# Altium schematic sheet Radio.SchDoc
size A3; DocumentNumber: 10; SheetNumber: 5; SheetTotal: 18
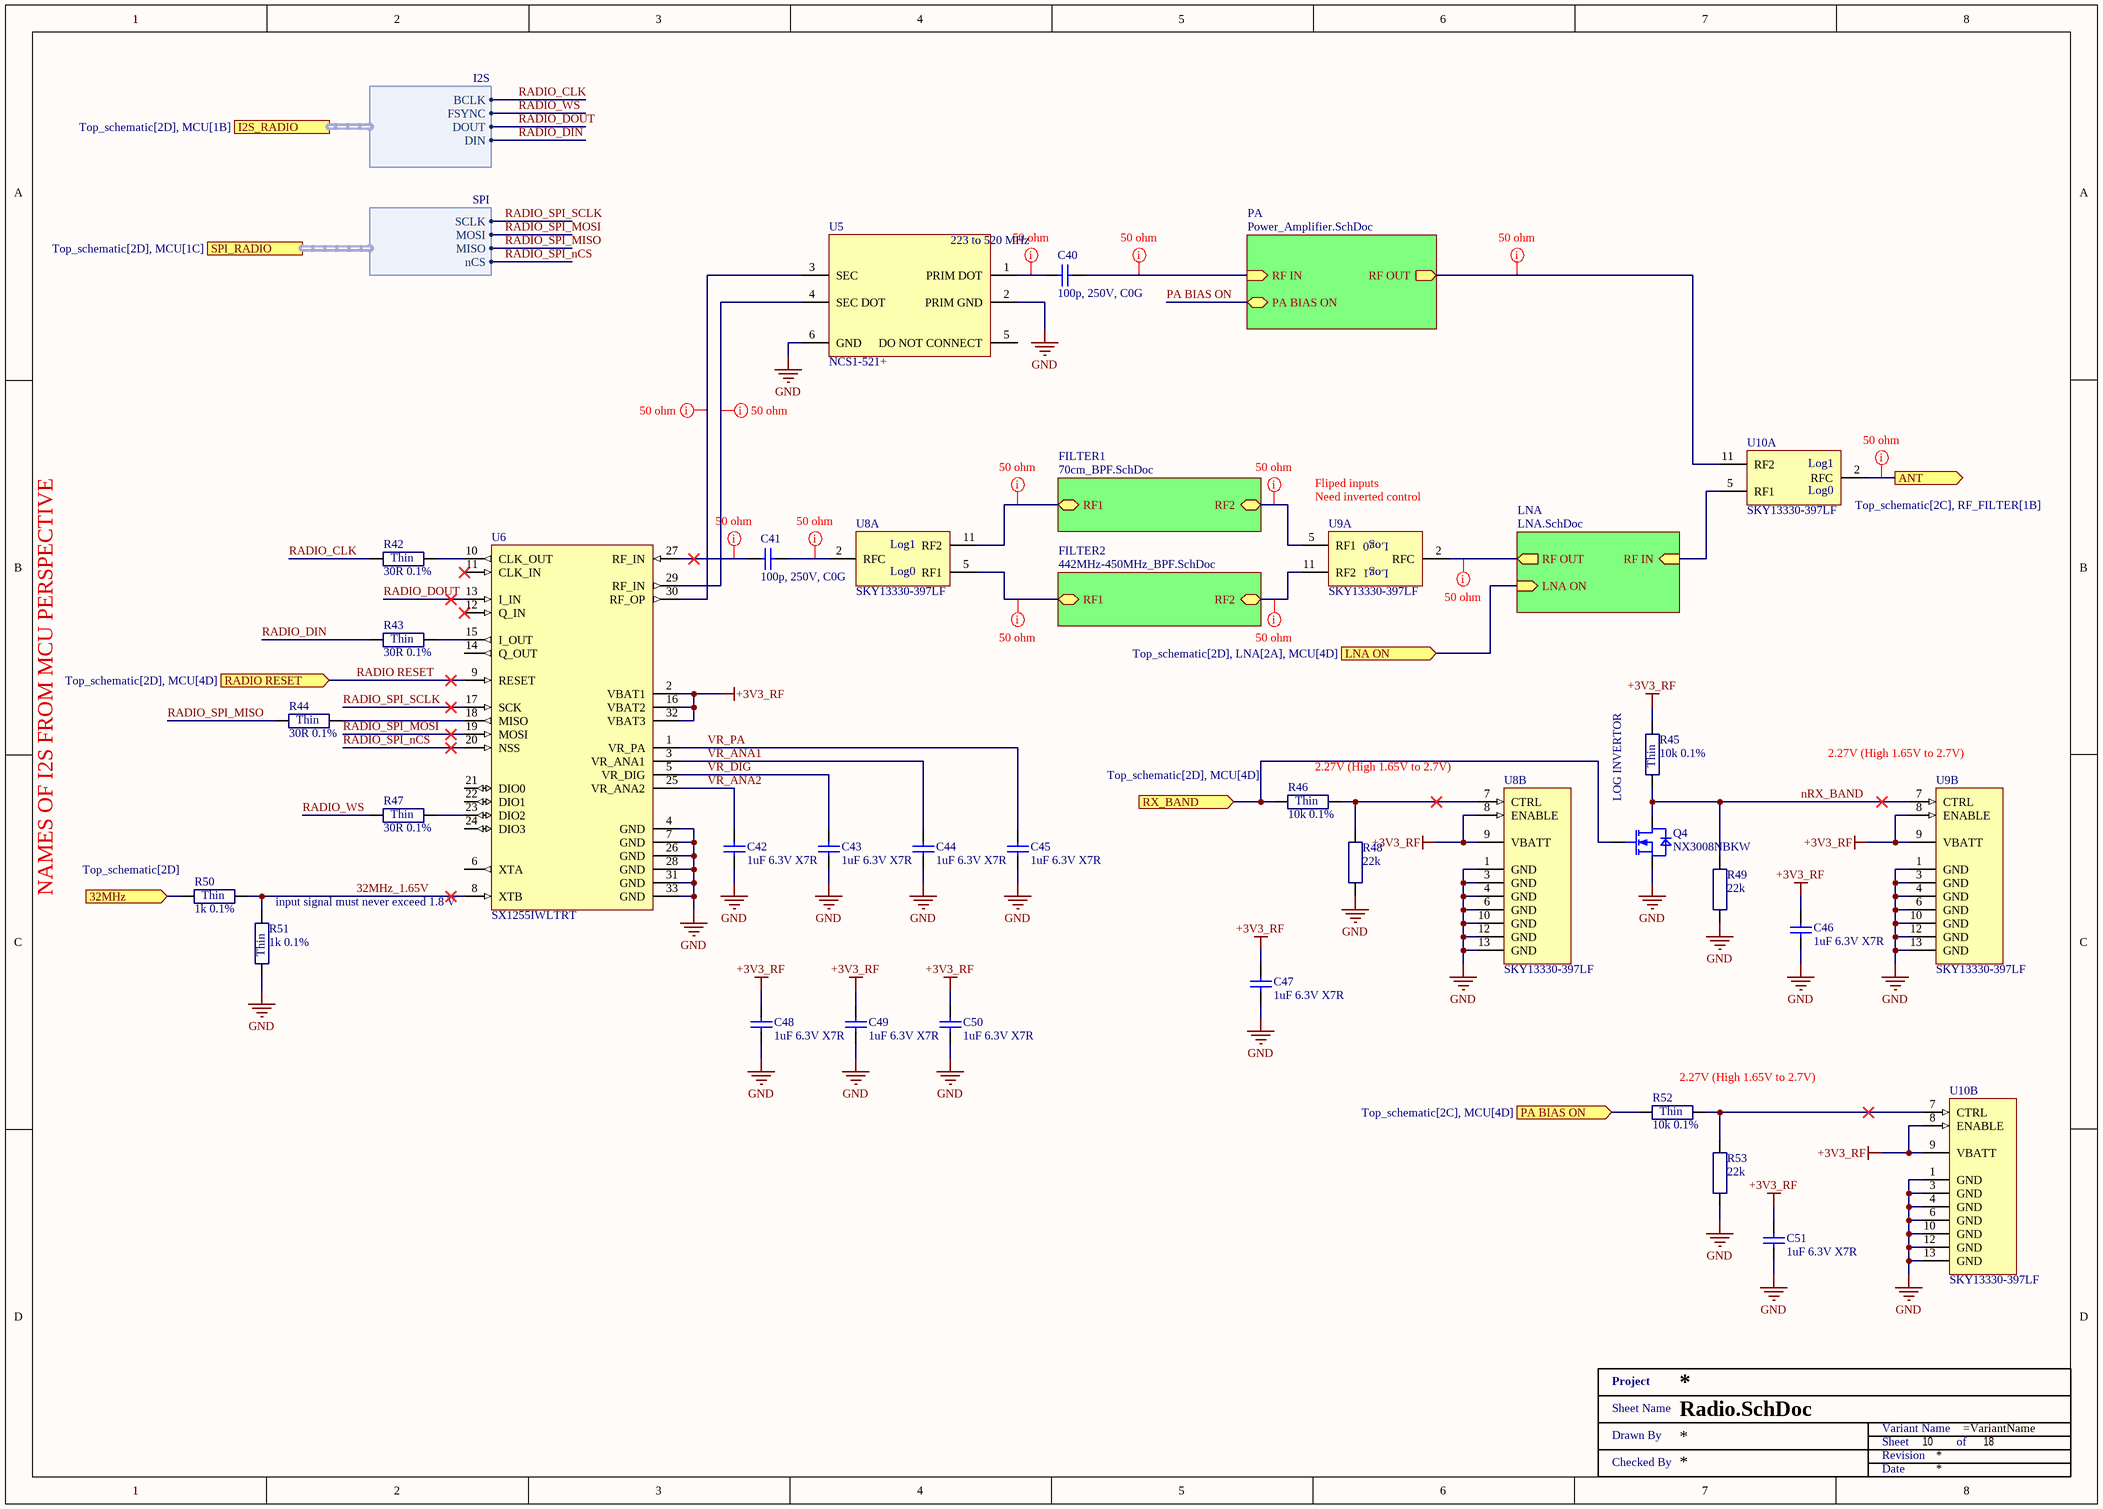
[diagram p0: Radio.SchDoc]

## Parts
C40  100p, 250V, C0G  [SMD0603]
C41  100p, 250V, C0G  [SMD0603]
C42  1uF 6.3V X7R  [SMD0402]
C43  1uF 6.3V X7R  [SMD0402]
C44  1uF 6.3V X7R  [SMD0402]
C45  1uF 6.3V X7R  [SMD0402]
C46  1uF 6.3V X7R  [SMD0402]
C47  1uF 6.3V X7R  [SMD0402]
C48  1uF 6.3V X7R  [SMD0402]
C49  1uF 6.3V X7R  [SMD0402]
C50  1uF 6.3V X7R  [SMD0402]
C51  1uF 6.3V X7R  [SMD0402]
Q4  NX3008NBKW  [SOT323]
R42  30R 0.1%  [SMD0402 - R]
R43  30R 0.1%  [SMD0402 - R]
R44  30R 0.1%  [SMD0402 - R]
R45  10k 0.1%  [SMD0402 - R]
R46  10k 0.1%  [SMD0402 - R]
R47  30R 0.1%  [SMD0402 - R]
R48  22k  [SMD0402 - R]
R49  22k  [SMD0402 - R]
R50  1k 0.1%  [SMD0402 - R]
R51  1k 0.1%  [SMD0402 - R]
R52  10k 0.1%  [SMD0402 - R]
R53  22k  [SMD0402 - R]
U5  NCS1-521+  [SMD_0805_6PIN_OPRAVA]
U6  SX1255IWLTRT  [QFN32-2]
U8  SKY13330-397LF  [QFN50P200X200X100_HS-13N]  (parts A,B of 2)
U9  SKY13330-397LF  [QFN50P200X200X100_HS-13N]  (parts A,B of 2)
U10  SKY13330-397LF  [QFN50P200X200X100_HS-13N]  (parts A,B of 2)
XX?  Title 1  (value not drawn)  (graphical)

## Sub-sheets
FILTER1 = 70cm_BPF.SchDoc: RF1 (bidir), RF2 (bidir)
FILTER2 = 442MHz-450MHz_BPF.SchDoc: RF1 (bidir), RF2 (bidir)
LNA = LNA.SchDoc: LNA ON (in), RF OUT (out), RF IN (in)
PA = Power_Amplifier.SchDoc: PA BIAS ON (bidir), RF IN (in), RF OUT (out)

## Ports
32MHz (in, see Top_schematic[2D]), ANT (out, see Top_schematic[2C], RF_FILTER[1B]), I2S_RADIO (harness I2S, see Top_schematic[2D], MCU[1B]), LNA ON (in, see Top_schematic[2D], LNA[2A], MCU[4D]), PA BIAS ON (in, see Top_schematic[2C], MCU[4D]), RADIO RESET (in, see Top_schematic[2D], MCU[4D]), RX_BAND (in, see Top_schematic[2D], MCU[4D]), SPI_RADIO (harness SPI, see Top_schematic[2D], MCU[1C])

## Harnesses
I2S: BCLK, FSYNC, DOUT, DIN
SPI: SCLK, nCS, MISO, MOSI

## Nets
+3V3_RF: C46.2 C47.2 C48.2 C49.2 C50.2 C51.2 R45.2 U6.2(VBAT1) U6.16(VBAT2) U6.32(VBAT3) U8.8(ENABLE) U8.9(VBATT) U9.8(ENABLE) U9.9(VBATT) U10.8(ENABLE) U10.9(VBATT)
GND: C42.1 C43.1 C44.1 C45.1 C46.1 C47.1 C48.1 C49.1 C50.1 C51.1 Q4.2(S) R48.1 R49.1 R51.1 R53.1 U5.2(PRIM_GND) U5.6(GND) U6.4(GND) U6.7(GND) U6.26(GND) U6.28(GND) U6.31(GND) U6.33(GND) U8.1(GND) U8.3(GND) U8.4(GND) U8.6(GND) U8.10(GND) U8.12(GND) U8.13(GND) U9.1(GND) U9.3(GND) U9.4(GND) U9.6(GND) U9.10(GND) U9.12(GND) U9.13(GND) U10.1(GND) U10.3(GND) U10.4(GND) U10.6(GND) U10.10(GND) U10.12(GND) U10.13(GND)
32MHz: R50.1 ; port 32MHz
32MHz_1.65V: R50.2 R51.2 U6.8(XTB)
ANT: U10.2(RFC) ; port ANT
LNA ON: port LNA ON, sheet LNA/LNA ON
nRX_BAND: Q4.3(D) R45.1 R49.2 U9.7(CTRL)
PA BIAS ON: R52.1 ; port PA BIAS ON
PA BIAS ON: sheet PA/PA BIAS ON  [a separate net that carries the same name]
RADIO RESET: U6.9(RESET) ; port RADIO RESET
RADIO_CLK: R42.1 ; port I2S_RADIO.BCLK
RADIO_DIN: R43.1 ; port I2S_RADIO.DIN
RADIO_DOUT: U6.13(I_IN) ; port I2S_RADIO.DOUT
RADIO_SPI_MISO: R44.1 ; port SPI_RADIO.MISO
RADIO_SPI_MOSI: U6.19(MOSI) ; port SPI_RADIO.MOSI
RADIO_SPI_nCS: U6.20(NSS) ; port SPI_RADIO.nCS
RADIO_SPI_SCLK: U6.17(SCK) ; port SPI_RADIO.SCLK
RADIO_WS: R47.1 ; port I2S_RADIO.FSYNC
RX_BAND: Q4.1(G) R46.1 ; port RX_BAND
VR_ANA1: C44.2 U6.3(VR_ANA1)
VR_ANA2: C42.2 U6.25(VR_ANA2)
VR_DIG: C43.2 U6.5(VR_DIG)
VR_PA: C45.2 U6.1(VR_PA)
NetC40_1: C40.1 U5.1(PRIM_DOT)
NetC40_2: C40.2 ; sheet PA/RF IN
NetC41_1: C41.1 U8.2(RFC)
NetC41_2: C41.2 U6.27(RF_IN)
NetR42_2: R42.2 U6.10(CLK_OUT)
NetR43_2: R43.2 U6.15(I_OUT)
NetR44_2: R44.2 U6.18(MISO)
NetR46_2: R46.2 R48.2 U8.7(CTRL)
NetR47_2: R47.2 U6.23(DIO2)
NetR52_2: R52.2 R53.2 U10.7(CTRL)
NetU5_3: U5.3(SEC) U6.30(RF_OP)
NetU5_4: U5.4(SEC_DOT) U6.29(RF_IN)
NetU8_5: U8.5(RF1) ; sheet FILTER2/RF1
NetU8_11: U8.11(RF2) ; sheet FILTER1/RF1
NetU9_2: U9.2(RFC) ; sheet LNA/RF OUT
NetU9_5: U9.5(RF1) ; sheet FILTER1/RF2
NetU9_11: U9.11(RF2) ; sheet FILTER2/RF2
NetU10_5: U10.5(RF1) ; sheet LNA/RF IN
NetU10_11: U10.11(RF2) ; sheet PA/RF OUT

Not connected (* = marked no-connect by the designer): U5 5(DO_NOT_CONNECT); U6 6(XTA) 11(CLK_IN)* 12(Q_IN)* 14(Q_OUT) 21(DIO0) 22(DIO1) 24(DIO3)

## Layout directives
net class 50 ohm: ANT, NetC40_1, NetC40_2, NetC41_1, NetC41_2, NetU5_3, NetU5_4, NetU8_5, NetU8_11, NetU9_2, NetU9_5, NetU9_11, NetU10_11

## Notes on the sheet
- Fliped inputs
- (near U9) Need inverted control
- 2.27V (High 1.65V to 2.7V)
- (near U9) 2.27V (High 1.65V to 2.7V)
- LOG INVERTOR
- NAMES OF I2S FROM MCU PERSPECTIVE
- (near U6) input signal must never exceed 1.8 V
- (near R52) 2.27V (High 1.65V to 2.7V)
- (in symbol NCS1-521+) 223 to 520 MHz
- (in symbol SKY13330-397LF, part A) Log1; Log0
- (in symbol TC0225B300JTCC) Thin
- (in symbol TC0225B1001TCC) Thin
- (in symbol TC0225B1002TCC) Thin
- (in symbol Title 1) Project; Sheet Name; Variant Name; Drawn By; Sheet; of; Revision; Checked By; Date

## Library data of the parts
C40 C41 = 885342006003: CAP CER 100PF 250V C0G/NP0 0603; Manufacturer: Wurth Electronics Inc.; Tolerance: ±5%; Temperature Coefficient: C0G, NP0; Notification: Current market demand for these product types have resulted in fluctuating and extending lead times. Lead times may differ.; Supplier 1: Digi-Key; Supplier Part Number 1: 732-12167-1-ND; Manufacturer Part Number: 885342006003; RoHS: RoHS Compliant; Category: Capacitors; Stock 1: 43; Pricing 1: 1=0.1, 10=0.043, 100=0.0385, 500=0.03406 (USD); Packaging: Cut Tape (CT); Part Status: Active; Voltage - Rated: 250V; Operating Temperature: -55°C ~ 125°C; Features: -; Ratings: -; Applications: General Purpose; Failure Rate: -; Mounting Type: Surface Mount, MLCC; Package / Case: 0603 (1608 Metric); Size / Dimension: 0.063" L x 0.031" W (1.60mm x 0.80mm); Height - Seated (Max): -; Thickness (Max): 0.034" (0.87mm); Lead Spacing: -; Lead Style: -; ComponentLink1URL: https://katalog.we-online.de/pbs/datasheet/885342006003.pdf; ComponentLink1Description: https://katalog.we-online.de/pbs/datasheet/885342006003.pdf; Supplier 2: Farnell; Supplier Part Number 2: 2812519; Supplier 3: Mouser; Supplier Part Number 3: 710-885342006003; Capacitance: 100p
C42-C51 = TCC0402X7R105K6R3AT: Capacitor: MLCC; SMD; 0402; 1µF; 6.3V; ±10%; X7R; CCTC; Capacitance: 1u; Supplier 1: LCSC; Supplier Part Number 1: C5448871; Manufacturer: CCTC; Manufacturer Part Number: TCC0402X7R105K6R3AT; Category: Ceramic Capacitors; Stock 1: 242350; Pricing 1: 50=0.0089, 500=0.0072, 1500=0.0063, 10000=0.0058, 20000=0.0053, 50000=0.005 (USD); ComponentLink1URL: https://datasheet.octopart.com:443/TCC0402X7R105K6R3AT-CCTC-datasheet-194166649.pdf?src-supplier=LCSC; ComponentLink1Description: https://datasheet.octopart.com:443/TCC0402X7R105K6R3AT-CCTC-datasheet-194166649.pdf?src-supplier=LCSC; ComponentLink2URL: https://datasheet.octopart.com:443/TCC0402X7R105K6R3AT-CCTC-datasheet-192317456.pdf?src-supplier=HQonline; ComponentLink2Description: https://datasheet.octopart.com:443/TCC0402X7R105K6R3AT-CCTC-datasheet-192317456.pdf?src-supplier=HQonline
Q4 = NX3008NBKW: NXP - NX3008NBKW - MOSFET, N CH, 30V, 350MA, SOT323; Transistor Polarity: N Channel; Continuous Drain Current Id: 350; Drain Source Voltage Vds: 30; On Resistance Rds(on): 1; Rds(on) Test Voltage Vgs: 4.5; Threshold Voltage Vgs: 900; Power Dissipation Pd: 260; Transistor Case Style: SOT-323; No. of Pins: 3; SVHC: No SVHC (17-Dec-2015); Pulse Current Idm: -0.8; Voltage Vgs th Max: 8; Manufacturer: NXP; Manufacturer Part Number: NX3008NBKW; RoHS: YES; Stock 1: 4764; Pricing 1: 1=0.0425, 25=0.0385, 100=0.0347, 250=0.0334, 500=0.0312, 2000=0.0291, 4000=0.0282, 20000=0.0273 (GBP); Operating Temperature Max: 150; Product Range: -; Automotive Qualification Standard: -; MSL: MSL 1 - Unlimited; Operating Temperature Min: -55; Operating Temperature Range: -55°C to +150; ComponentLink1URL: http://www.farnell.com/datasheets/1508392.pdf; ComponentLink1Description: http://www.farnell.com/datasheets/1508392.pdf; Supplier 1: Mouser; Supplier Part Number 1: 771-NX3008NBKW,115; Supplier 2: Farnell; Supplier Part Number 2: 2069546; Supplier 3: Arrow; Supplier Part Number 3: NX3008NBKW,115
R42-R44 R47 = TC0225B300JTCC: Resistor: thin film; SMD; 0402; 30Ω; 62.5mW; ±0.1%; TC25; 25V; -55÷155°C; Manufacturer: Uniroyal; Supplier 1: LCSC; Supplier Part Number 1: C50670254; Manufacturer Part Number: TC0225B300JTCC; Category: Uncategorized; Stock 1: 4950; Pricing 1: 50=0.0203, 500=0.0161, 1500=0.0137, 10000=0.0123, 20000=0.0111, 50000=0.0104 (USD); ComponentLink1URL: https://datasheet.octopart.com:443/TC0225B300JTCC-Uniroyal-datasheet-194228366.pdf?src-supplier=LCSC; ComponentLink1Description: https://datasheet.octopart.com:443/TC0225B300JTCC-Uniroyal-datasheet-194228366.pdf?src-supplier=LCSC; Resistance: 30R
R45 R46 R52 = TC0225B1002TCC: Fixed Resistor, Thin Film, 0.0625W, 10000ohm, 50V, 0.1% +/-Tol, Surface Mount, 0402; Manufacturer: Uniroyal; Power Rating: 62.5mW; Supplier 1: LCSC; Supplier Part Number 1: C2989267; Manufacturer Part Number: TC0225B1002TCC; Category: Chip SMD Resistors; Stock 1: 10200; Pricing 1: 20=0.0396, 200=0.0352, 600=0.0327, 2000=0.0312, 10000=0.0299, 20000=0.0292 (USD); Case/Package: 0402; Composition: Thin Film; Export Control Classification Number (ECCN) Code: EAR99; Height: 300µm; Harmonized Tariff Schedule (HTS) Code: 8533.21.00.30; Length: 1mm; Lifecycle Status: Production; Max Operating Temperature: 155°C; Min Operating Temperature: -55°C; Mounting Technology: Surface Mount; Number of Terminals: 2; Resistance: 10k; Tolerance: 0.1%; Width: 500µm; Working Voltage: 50V; ComponentLink1URL: https://datasheet.octopart.com:443/TC0225B1002TCC-Uniroyal-datasheet-194228365.pdf?src-supplier=LCSC; ComponentLink1Description: https://datasheet.octopart.com:443/TC0225B1002TCC-Uniroyal-datasheet-194228365.pdf?src-supplier=LCSC
R48 R49 R53 = RC0402FR-0722KL: Res Thick Film 0402 22K Ohm 1% 0.063W(1/16W) ±100ppm/C Pad SMD T/R; Manufacturer: Yageo Group; Max Power Dissipation: 63mW; Power Rating: 62.5mW; Temperature Coefficient: 100ppm/°C; Voltage Rating: 50V; Supplier 1: Mouser; Supplier Part Number 1: 603-RC0402FR-0722KL; Manufacturer Part Number: RC0402FR-0722KL; RoHS: Compliant; Category: Chip SMD Resistors; Stock 1: 473074; Pricing 1: 1=0.1, 10=0.009, 50=0.009, 100=0.007, 1000=0.006, 10000=0.002 (USD); Case/Package: 0402; Case Code (Imperial): 0402; China RoHS: Non-Compliant; Composition: Thick Film; Depth: 500µm; Features: Moisture Resistant; Height: 350µm; Lead Free: Lead Free; Length: 1mm; Lifecycle Status: Production; Max Operating Temperature: 155°C; Military Standard: Not; Min Operating Temperature: -55°C; Mounting Technology: Surface Mount; Pins: 2; Number of Terminals: 2; Number of Terminations: 2; Packaging: Tape & Reel; REACH SVHC: Yes; Resistance: 22k; Schedule B: 8533210045, 8533210045|8533210045, 8533210045|8533210045|8533210045, 8533210045|8533210045|8533210045|8533210045; Termination: SMD/SMT; Tolerance: 1%; Voltage Rating (AC): 50V; Voltage Rating (DC): 50V; Width: 500µm; Working Voltage: 50V; ComponentLink1URL: https://datasheet.octopart.com:443/RC0402FR-0722KL-Yageo-datasheet-175887523.pdf?src-supplier=IHS; ComponentLink1Description: https://datasheet.octopart.com:443/RC0402FR-0722KL-Yageo-datasheet-175887523.pdf?src-supplier=IHS; ComponentLink2URL: https://datasheet.octopart.com:443/RC0402FR-0722KL-Yageo-datasheet-10408619.pdf?src-supplier=element14+APAC; ComponentLink2Description: https://datasheet.octopart.com:443/RC0402FR-0722KL-Yageo-datasheet-10408619.pdf?src-supplier=element14+APAC; ComponentLink3URL: https://datasheet.octopart.com:443/RC0402FR-0722KL-Yageo-datasheet-62067350.pdf?src-supplier=element14+APAC; ComponentLink3Description: https://datasheet.octopart.com:443/RC0402FR-0722KL-Yageo-datasheet-62067350.pdf?src-supplier=element14+APAC; ComponentLink4URL: https://datasheet.octopart.com:443/RC0402FR-0722KL-Yageo-datasheet-103092701.pdf?src-supplier=Upverter; ComponentLink4Description: https://datasheet.octopart.com:443/RC0402FR-0722KL-Yageo-datasheet-103092701.pdf?src-supplier=Upverter; ComponentLink5URL: https://datasheet.octopart.com:443/RC0402FR-0722KL-Yageo-Group-datasheet-190305687.pdf?src-supplier=Future+Electronics; ComponentLink5Description: https://datasheet.octopart.com:443/RC0402FR-0722KL-Yageo-Group-datasheet-190305687.pdf?src-supplier=Future+Electronics; ComponentLink6URL: https://datasheet.octopart.com:443/RC0402FR-0722KL-Yageo-datasheet-164759695.pdf?src-supplier=Future+Electronics; ComponentLink6Description: https://datasheet.octopart.com:443/RC0402FR-0722KL-Yageo-datasheet-164759695.pdf?src-supplier=Future+Electronics; ComponentLink7URL: https://datasheet.octopart.com:443/RC0402FR-0722KL-Yageo-datasheet-137700087.pdf?src-supplier=Future+Electronics; ComponentLink7Description: https://datasheet.octopart.com:443/RC0402FR-0722KL-Yageo-datasheet-137700087.pdf?src-supplier=Future+Electronics; ComponentLink8URL: https://datasheet.octopart.com:443/RC0402FR-0722KL-Yageo-datasheet-12531192.pdf?src-supplier=Future+Electronics; ComponentLink8Description: https://datasheet.octopart.com:443/RC0402FR-0722KL-Yageo-datasheet-12531192.pdf?src-supplier=Future+Electronics; ComponentLink9URL: https://datasheet.octopart.com:443/RC0402FR-0722KL-Yageo-datasheet-8324255.pdf?src-supplier=Future+Electronics; ComponentLink9Description: https://datasheet.octopart.com:443/RC0402FR-0722KL-Yageo-datasheet-8324255.pdf?src-supplier=Future+Electronics; ComponentLink10URL: https://datasheet.octopart.com:443/RC0402FR-0722KL-Yageo-datasheet-8329306.pdf?src-supplier=element14; ComponentLink10Description: https://datasheet.octopart.com:443/RC0402FR-0722KL-Yageo-datasheet-8329306.pdf?src-supplier=element14; ComponentLink11URL: https://datasheet.octopart.com:443/RC0402FR-0722KL-Yageo-datasheet-8324527.pdf?src-supplier=Newark; ComponentLink11Description: https://datasheet.octopart.com:443/RC0402FR-0722KL-Yageo-datasheet-8324527.pdf?src-supplier=Newark; ComponentLink12URL: https://datasheet.octopart.com:443/RC0402FR-0722KL-Yageo-Group-datasheet-189192902.pdf?src-supplier=LCSC; ComponentLink12Description: https://datasheet.octopart.com:443/RC0402FR-0722KL-Yageo-Group-datasheet-189192902.pdf?src-supplier=LCSC; ComponentLink13URL: https://datasheet.octopart.com:443/RC0402FR-0722KL-Yageo-datasheet-175423674.pdf?src-supplier=SOS+electronic; ComponentLink13Description: https://datasheet.octopart.com:443/RC0402FR-0722KL-Yageo-datasheet-175423674.pdf?src-supplier=SOS+electronic; ComponentLink14URL: https://datasheet.octopart.com:443/RC0402FR-0722KL-Yageo-datasheet-148775077.pdf?src-supplier=TME; ComponentLink14Description: https://datasheet.octopart.com:443/RC0402FR-0722KL-Yageo-datasheet-148775077.pdf?src-supplier=TME; ComponentLink15URL: https://datasheet.octopart.com:443/RC0402FR-0722KL-Yageo-datasheet-79472498.pdf?src-supplier=Megastar; ComponentLink15Description: https://datasheet.octopart.com:443/RC0402FR-0722KL-Yageo-datasheet-79472498.pdf?src-supplier=Megastar; ComponentLink16URL: https://datasheet.octopart.com/RC0402FR-0722KL-Yageo-datasheet-73766026.pdf; ComponentLink16Description: https://datasheet.octopart.com/RC0402FR-0722KL-Yageo-datasheet-73766026.pdf; ComponentLink17URL: http://sigma.octopart.com:80/conflict_mineral_statement/Yageo-company-3.pdf?src-supplier=Compliance+Statements; ComponentLink17Description: http://sigma.octopart.com:80/conflict_mineral_statement/Yageo-company-3.pdf?src-supplier=Compliance+Statements; ComponentLink18URL: http://sigma.octopart.com:80/rohs_statement/Yageo-company-2.pdf?src-supplier=Compliance+Statements; ComponentLink18Description: http://sigma.octopart.com:80/rohs_statement/Yageo-company-2.pdf?src-supplier=Compliance+Statements; Supplier 2: LCSC; Supplier Part Number 2: C82868
R50 R51 = TC0225B1001TCC: 62.5mW Thin Film Resistor 25V ±25ppm/℃ ±0.1% 1kΩ 0402 Chip Resistor - Surface Mount ROHS; Manufacturer: Uniroyal; Working Voltage: 50V; Supplier 1: LCSC; Supplier Part Number 1: C2989674; Manufacturer Part Number: TC0225B1001TCC; Category: Chip SMD Resistors; Stock 1: 12060; Pricing 1: 20=0.036, 200=0.031, 600=0.0283, 2000=0.0267, 10000=0.0252, 20000=0.0245 (USD); Case/Package: 0402; Composition: Thin Film; Export Control Classification Number (ECCN) Code: EAR99; Height: 300µm; Harmonized Tariff Schedule (HTS) Code: 8533.21.00.30; Length: 1mm; Lifecycle Status: Production; Max Operating Temperature: 155°C; Min Operating Temperature: -55°C; Mounting Technology: Surface Mount; Number of Terminals: 2; Power Rating: 62.5mW; Resistance: 1k; Tolerance: 0.1%; Width: 500µm; ComponentLink1URL: https://datasheet.octopart.com:443/TC0225B1001TCC-Uniroyal-datasheet-194228365.pdf?src-supplier=LCSC; ComponentLink1Description: https://datasheet.octopart.com:443/TC0225B1001TCC-Uniroyal-datasheet-194228365.pdf?src-supplier=LCSC
U5 = NCS1-521+: 1: 1 LTCC TRANSFORMER, 223 - 520 / RF Balun 223MHz ~ 520MHz 50 / 50Ohm 0805 (2012 Metric), 6 PC Pad; Manufacturer: Mini-Circuits; Insertion Loss (dB): 1.5dB; Supplier 1: Mouser; Supplier Part Number 1: 139-NCS1-521; Manufacturer Part Number: NCS1-521+; RoHS: Compliant; Category: Transformers; Stock 1: 205; Pricing 1: 1=1.5, 10=1.5, 50=1.5, 100=1.41, 1000=1.39, 10000=1.39 (USD); Height: 840µm; Length: 2mm; Lifecycle Status: Production; Clock Frequency: 520MHz; Max Operating Temperature: 85°C; Min Operating Temperature: -40°C; Mounting Technology: Surface Mount; Width: 1.24mm; ComponentLink1URL: https://datasheet.octopart.com:443/NCS1-521%2B-Mini-Circuits-datasheet-180702109.pdf?src-supplier=IHS; ComponentLink1Description: https://datasheet.octopart.com:443/NCS1-521%2B-Mini-Circuits-datasheet-180702109.pdf?src-supplier=IHS
U6 = SX1255IWLTRT: IC RF TXRX 802.15.4 32WFQFN / Low Power Digital I and Q RF Multi-PHY Mode Transceiver; Manufacturer: Semtech; Current - Receiving: 18mA; Current - Transmitting: 60mA; Frequency: 510MHz; Interface: SPI; Max Supply Current: 90mA; Nominal Supply Voltage (DC): 3.3V; Number of Circuits: 1; Number of GPIO: 4; Supplier: Mouser; Supplier Part Number: 947-SX1255IWLTRT; Manufacturer Part Number: SX1255IWLTRT; RoHS: Compliant; Category: RF Receivers, Transceivers; Stock: 2563; Pricing: 1=13,45, 10=11,23, 50=10,54, 100=9,71, 1000=8,78, 10000=7,98 (USD); China RoHS: Compliant; Country of Origin: Malaysia; Height - Seated (Max): 800µm; Introduction Date: 2013-10-17; Lead Free: Lead Free; Length: 5mm; Lifecycle Status: Production; Max Operating Temperature: 85°C; Min Operating Temperature: -40°C; Number of Terminals: 32; Packaging: Tape & Reel (TR); REACH SVHC: Yes; Terminal Pitch: 500µm; Width: 5mm; ComponentLink1URL: https://datasheet.octopart.com:443/SX1255IWLTRT-Semtech-datasheet-104525317.pdf?src-supplier=IHS; ComponentLink1Description: https://datasheet.octopart.com:443/SX1255IWLTRT-Semtech-datasheet-104525317.pdf?src-supplier=IHS; ComponentLink2URL: https://datasheet.octopart.com:443/SX1255IWLTRT-Semtech-datasheet-62277831.pdf?src-supplier=Future+Electronics; ComponentLink2Description: https://datasheet.octopart.com:443/SX1255IWLTRT-Semtech-datasheet-62277831.pdf?src-supplier=Future+Electronics; ComponentLink3URL: https://datasheet.octopart.com:443/SX1255IWLTRT-Semtech-datasheet-101951905.pdf?src-supplier=Future+Electronics; ComponentLink3Description: https://datasheet.octopart.com:443/SX1255IWLTRT-Semtech-datasheet-101951905.pdf?src-supplier=Future+Electronics; Supplier 1: Mouser; Supplier Part Number 1: 947-SX1255IWLTRT; Supplier 2: LCSC; Supplier Part Number 2: C89372
U8-U10 = SKY13330-397LF: RF Switch SP2T 100MHz to 6GHz 16dB Automotive 12-Pin QFN EP; Manufacturer: Skyworks Solutions; Throw Configuration: SPDT; P1dB: 39dBm; Impedance: 50R; Insertion Loss: 0.65dB; Turn-Off Delay Time: 1.6us; Supplier 1: Mouser; Supplier Part Number 1: 873-SKY13330-397LF; Manufacturer Part Number: SKY13330-397LF; RoHS: Yes; Category: RF Semiconductors and Devices; Pricing 1: 1=1.02000, 10=0.86600, 50=0.86600, 100=0.66600, 500=0.58800, 1000=0.46500, 3000=0.43000, 10000=0.43000 (USD); Mount: Surface Mount; Case/Package: QFN; Number of Pins: 12; Contact Plating: Tin,Matte; Weight: 0.000776oz; Min Operating Temperature: -40°C; Max Operating Temperature: 85°C; Frequency: 100MHz; Packaging: Tape and Reel; Package Quantity: 3000; Turn-On Delay Time: 1.6us; Max Frequency: 6GHz; Radiation Hardening: No; ComponentLink1URL: https://datasheet.ciiva.com/15100/getdatasheetpartid-656010-15100460.pdf?src-supplier=Verical; ComponentLink1Description: https://datasheet.ciiva.com/15100/getdatasheetpartid-656010-15100460.pdf?src-supplier=Verical; Supplier 2: Digi-Key; Supplier Part Number 2: 863-1643-2-ND; Supplier 3: Arrow Electronics; Supplier Part Number 3: SKY13330-397LF